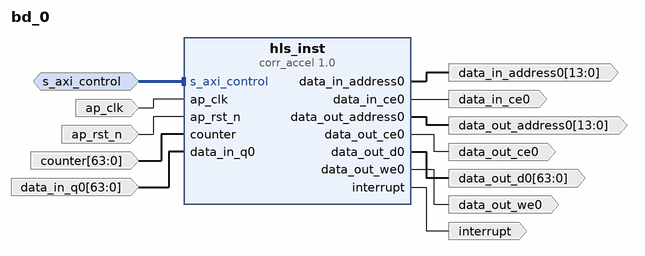
[diagram p0: block diagram of the top level]
# Vivado block design bd_0, xczu7ev-ffvc1156-2-e, Vivado 2022.2
create_bd_design bd_0

create_bd_intf_port -mode Slave -vlnv xilinx.com:interface:aximm_rtl:1.0 s_axi_control
set_property -dict [list \
  CONFIG.ADDR_WIDTH 32 \
  CONFIG.ARUSER_WIDTH 0 \
  CONFIG.AWUSER_WIDTH 0 \
  CONFIG.BUSER_WIDTH 0 \
  CONFIG.DATA_WIDTH 32 \
  CONFIG.FREQ_HZ 100000000.0 \
  CONFIG.HAS_BRESP 1 \
  CONFIG.HAS_BURST 0 \
  CONFIG.HAS_CACHE 0 \
  CONFIG.HAS_LOCK 0 \
  CONFIG.HAS_PROT 0 \
  CONFIG.HAS_QOS 0 \
  CONFIG.HAS_REGION 0 \
  CONFIG.HAS_RRESP 1 \
  CONFIG.HAS_WSTRB 1 \
  CONFIG.ID_WIDTH 0 \
  CONFIG.MAX_BURST_LENGTH 1 \
  CONFIG.NUM_READ_OUTSTANDING 1 \
  CONFIG.NUM_READ_THREADS 1 \
  CONFIG.NUM_WRITE_OUTSTANDING 1 \
  CONFIG.NUM_WRITE_THREADS 1 \
  CONFIG.PROTOCOL AXI4LITE \
  CONFIG.READ_WRITE_MODE READ_WRITE \
  CONFIG.RUSER_BITS_PER_BYTE 0 \
  CONFIG.RUSER_WIDTH 0 \
  CONFIG.SUPPORTS_NARROW_BURST 0 \
  CONFIG.WUSER_BITS_PER_BYTE 0 \
  CONFIG.WUSER_WIDTH 0 \
] [get_bd_intf_ports s_axi_control]
create_bd_port -dir I -type clk ap_clk
set_property -dict {CONFIG.FREQ_HZ 100000000.0} [get_bd_ports ap_clk]
create_bd_port -dir I -type rst ap_rst_n
create_bd_port -dir I -from 63 -to 0 -type data counter
create_bd_port -dir O -from 13 -to 0 -type data data_in_address0
create_bd_port -dir O data_in_ce0
create_bd_port -dir I -from 63 -to 0 -type data data_in_q0
create_bd_port -dir O -from 13 -to 0 -type data data_out_address0
create_bd_port -dir O data_out_ce0
create_bd_port -dir O -from 63 -to 0 -type data data_out_d0
create_bd_port -dir O data_out_we0
create_bd_port -dir O -type intr interrupt

create_bd_cell -type ip -vlnv xilinx.com:hls:corr_accel:1.0 hls_inst

# ---- connections ----

connect_bd_intf_net -intf_net s_axi_control_0_1 [get_bd_intf_ports s_axi_control] [get_bd_intf_pins hls_inst/s_axi_control]
connect_bd_net -net ap_clk_0_1 [get_bd_ports ap_clk] [get_bd_pins hls_inst/ap_clk]
connect_bd_net -net ap_rst_n_0_1 [get_bd_ports ap_rst_n] [get_bd_pins hls_inst/ap_rst_n]
connect_bd_net -net counter_0_1 [get_bd_ports counter] [get_bd_pins hls_inst/counter]
connect_bd_net -net data_in_q0_0_1 [get_bd_ports data_in_q0] [get_bd_pins hls_inst/data_in_q0]
connect_bd_net [get_bd_pins hls_inst/data_in_address0] [get_bd_ports data_in_address0]
connect_bd_net [get_bd_pins hls_inst/data_in_ce0] [get_bd_ports data_in_ce0]
connect_bd_net [get_bd_pins hls_inst/data_out_address0] [get_bd_ports data_out_address0]
connect_bd_net [get_bd_pins hls_inst/data_out_ce0] [get_bd_ports data_out_ce0]
connect_bd_net [get_bd_pins hls_inst/data_out_d0] [get_bd_ports data_out_d0]
connect_bd_net [get_bd_pins hls_inst/data_out_we0] [get_bd_ports data_out_we0]
connect_bd_net [get_bd_pins hls_inst/interrupt] [get_bd_ports interrupt]

# ---- address map ----
assign_bd_address -offset 0x00000000 -range 64K -target_address_space [get_bd_addr_spaces s_axi_control] [get_bd_addr_segs hls_inst/s_axi_control/Reg]

validate_bd_design
save_bd_design
